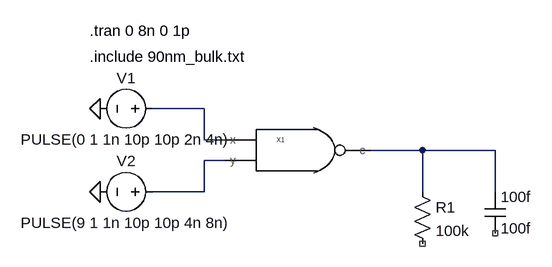
[diagram p0: schematic short.asc]
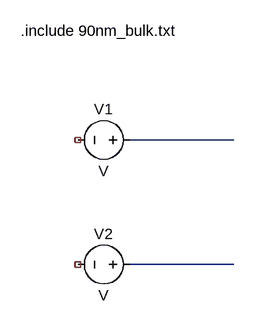
[diagram p1: sub-circuit nand.asc]
short.asc, the LTspice schematic file:
Version 4
SHEET 1 880 680
WIRE -48 64 -128 64
WIRE -48 112 -48 64
WIRE -16 112 -48 112
WIRE 288 128 208 128
WIRE 400 128 288 128
WIRE -16 144 -48 144
WIRE -48 192 -48 144
WIRE -48 192 -128 192
WIRE 288 192 288 128
WIRE 400 192 400 128
FLAG -208 64 0
FLAG -208 192 0
SYMBOL nand 64 112 R0
WINDOW 0 0 0 Left 0
WINDOW 39 0 28 Left 0
SYMATTR InstName X1
SYMBOL voltage -112 64 R90
WINDOW 0 -32 56 VBottom 2
WINDOW 3 32 56 VTop 2
WINDOW 123 0 0 Left 0
WINDOW 39 0 0 Left 0
SYMATTR InstName V1
SYMATTR Value PULSE(0 1 1n 10p 10p 2n 4n)
SYMBOL voltage -112 192 R90
WINDOW 0 -32 56 VBottom 2
WINDOW 3 32 56 VTop 2
WINDOW 123 0 0 Left 0
WINDOW 39 0 0 Left 0
SYMATTR InstName V2
SYMATTR Value PULSE(9 1 1n 10p 10p 4n 8n)
SYMBOL res 272 176 R0
SYMATTR InstName R1
SYMATTR Value 100k
SYMBOL cap 384 192 R0
SYMATTR InstName 100f
SYMATTR Value 100f
TEXT -224 -16 Left 2 !.include 90nm_bulk.txt
TEXT -224 -56 Left 2 !.tran 0 8n 0 1p

nand.asc, the sub-circuit schematic file:
Version 4
SHEET 1 880 680
WIRE 80 224 -80 224
WIRE 80 416 -80 416
SYMBOL voltage -64 224 R90
WINDOW 0 -32 56 VBottom 2
WINDOW 3 32 56 VTop 2
SYMATTR InstName V1
SYMBOL voltage -64 416 R90
WINDOW 0 -32 56 VBottom 2
WINDOW 3 32 56 VTop 2
SYMATTR InstName V2
TEXT -248 56 Left 2 !.include 90nm_bulk.txt

The netlist it stands for:
* short.asc
XX1 N001 N003 N002 nand
V1 N001 0 PULSE(0 1 1n 10p 10p 2n 4n)
V2 N003 0 PULSE(9 1 1n 10p 10p 4n 8n)
R1 N002 NC_01 100k
C§100f N002 NC_02 100f

* block symbol definitions
.subckt nand x y c
V1 N001 NC_01 V
V2 N002 NC_02 V
.include 90nm_bulk.txt
.ends nand

.include 90nm_bulk.txt
.tran 0 8n 0 1p
.backanno
.end